# EAGLE design forno-pcb2 (EAGLE 6.5.0)
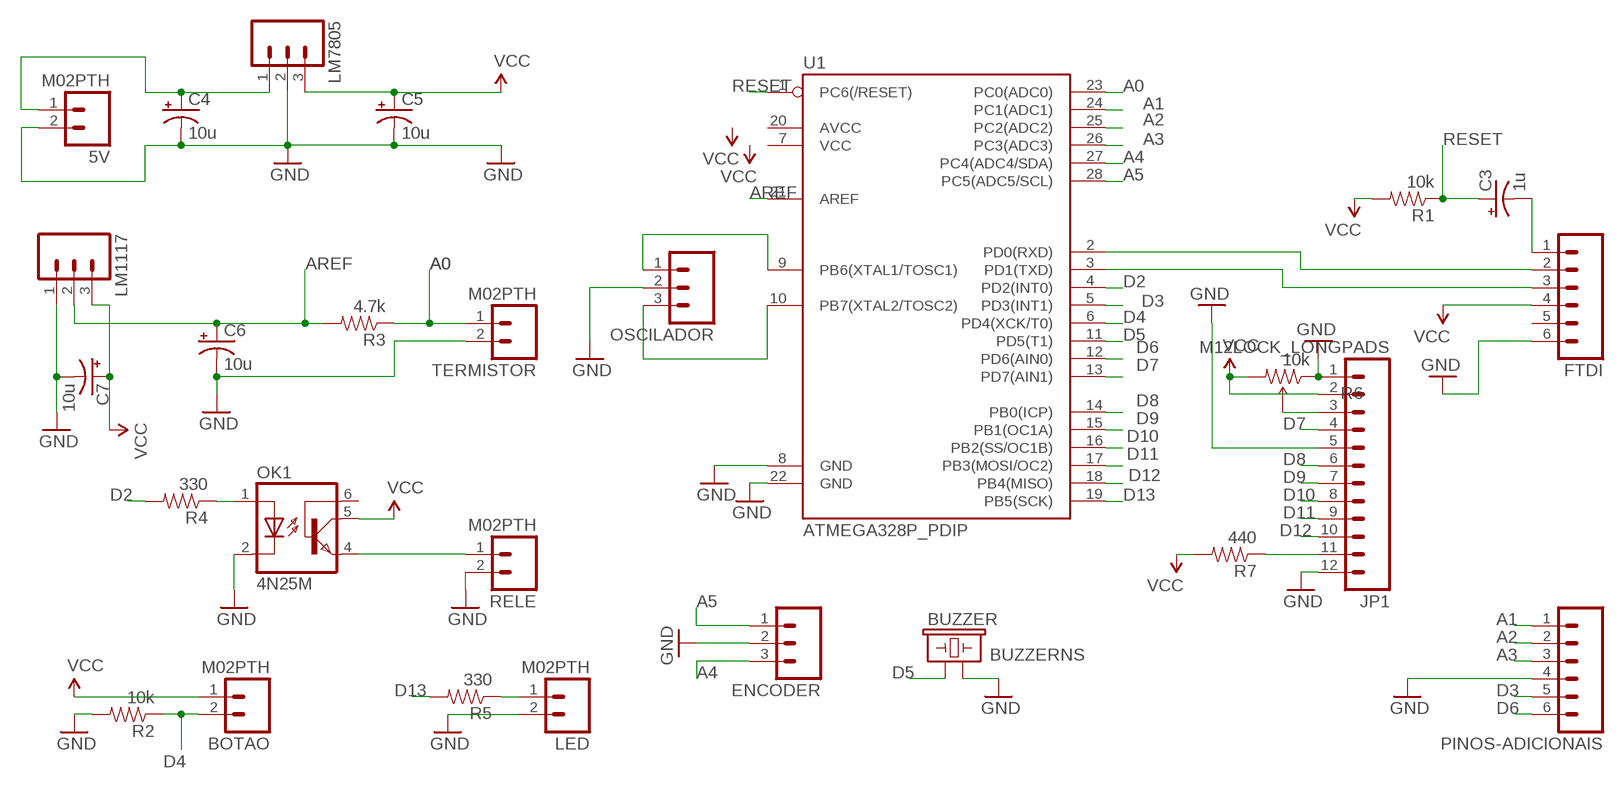
[diagram p0: schematic, sheet 1]

## Parts
5V  M02PTH  [1X02]
BOTAO  M02PTH  [1X02]
BUZZER  BUZZERNS  [BUZZER-12MM-NS]
C3  1u  CAP_POLPTH2  [CPOL-RADIAL-10UF-25V]
C4  10u  CAP_POLPTH2  [CPOL-RADIAL-10UF-25V]
C5  10u  CAP_POLPTH2  [CPOL-RADIAL-10UF-25V]
C6  10u  CAP_POLPTH2  [CPOL-RADIAL-10UF-25V]
C7  10u  CAP_POLPTH2  [CPOL-RADIAL-10UF-25V]
ENCODER  M03POLAR  [MOLEX-1X3]
FTDI  M06SIP  [1X06]
JP1  M12LOCK_LONGPADS  [1X12_LOCK_LONGPADS]
LED  M02PTH  [1X02]
LM1117  M03POLAR  [MOLEX-1X3]
LM7805  M03POLAR  [MOLEX-1X3]
OK1  4N25M  [DIL06]
OSCILADOR  M03POLAR  [MOLEX-1X3]
PINOS-ADICIONAIS  M06SIP  [1X06]
R1  10k  RESISTORPTH-1/6W  [1/6W-RES]
R2  10k  RESISTORPTH-1/6W  [1/6W-RES]
R3  4.7k  RESISTORPTH-1/6W  [1/6W-RES]
R4  330  RESISTORPTH-1/6W  [1/6W-RES]
R5  330  RESISTORPTH-1/6W  [1/6W-RES]
R6  10k  TRIMPOTPTH  [TRIM_POT_PTH]
R7  440  RESISTORPTH-1/6W  [1/6W-RES]
RELE  M02PTH  [1X02]
TERMISTOR  M02PTH  [1X02]
U1  ATMEGA328P_PDIP  [DIL28-3]

## Nets
A0: R3.1 TERMISTOR.1 U1.23(PC0(ADC0))
A1: PINOS-ADICIONAIS.1 U1.24(PC1(ADC1))
A2: PINOS-ADICIONAIS.2 U1.25(PC2(ADC2))
A3: PINOS-ADICIONAIS.3 U1.26(PC3(ADC3))
A4: ENCODER.3 U1.27(PC4(ADC4/SDA))
A5: ENCODER.1 U1.28(PC5(ADC5/SCL))
AREF: C6.1(+) LM1117.2 R3.2 U1.21(AREF)
D2: R4.2 U1.4(PD2(INT0))
D3: PINOS-ADICIONAIS.5 U1.5(PD3(INT1))
D4: BOTAO.2 R2.1 U1.6(PD4(XCK/T0))
D5: BUZZER.+ U1.11(PD5(T1))
D6: PINOS-ADICIONAIS.6 U1.12(PD6(AIN0))
D7: JP1.4 U1.13(PD7(AIN1))
D8: JP1.6 U1.14(PB0(ICP))
D9: JP1.7 U1.15(PB1(OC1A))
D10: JP1.8 U1.16(PB2(SS/OC1B))
D11: JP1.9 U1.17(PB3(MOSI/OC2))
D12: JP1.10 U1.18(PB4(MISO))
D13: R5.2 U1.19(PB5(SCK))
GND: 5V.2 BUZZER.- C4.2(-) C5.2(-) C6.2(-) C7.2(-) ENCODER.2 FTDI.6 JP1.1 JP1.5 JP1.12 LED.2 LM1117.1 LM7805.2 OK1.2(C) OSCILADOR.2 PINOS-ADICIONAIS.4 R2.2 R6.1(CCW) RELE.2 TERMISTOR.2 U1.8(GND) U1.22(GND)
N$1: FTDI.2 U1.2(PD0(RXD))
N$2: FTDI.3 U1.3(PD1(TXD))
N$3: C3.2(-) FTDI.1
N$4: 5V.1 C4.1(+) LM7805.1
N$5: OK1.1(A) R4.1
N$6: OK1.4(EMI) RELE.1
N$7: OSCILADOR.1 U1.9(PB6(XTAL1/TOSC1))
N$8: OSCILADOR.3 U1.10(PB7(XTAL2/TOSC2))
N$9: LED.1 R5.1
N$11: JP1.3 R6.2(WIPER)
N$28: JP1.11 R7.1
RESET: C3.1(+) R1.1 U1.1(PC6(/RESET))
VCC: BOTAO.1 C5.1(+) C7.1(+) FTDI.4 JP1.2 LM1117.3 LM7805.3 OK1.5(COL) R1.2 R6.3(CW) R7.2
Unconnected: FTDI.5 OK1.6(BAS) U1.7(VCC) U1.20(AVCC)

## Library data of the parts
5V BOTAO LED RELE TERMISTOR = SparkFun-Connectors:M02: Standard 2-pin 0.1" header. Use with - straight break away headers ( PRT-00116) - right angle break away headers (PRT-00553) - swiss pins (PRT-00743) - machine pins (PRT-00117) - female headers (PRT-00115) Molex polarized connector foot print use with: PRT-08233 with associated crimp pins and housings. 2.54_SCREWTERM for use with PRT-10571. 3.5mm Screw Terminal footprints for PRT-08084 5mm Screw Terminal footprints for use with PRT-08433
BUZZER = SparkFun-Electromechanical:BUZZER: Buzzer 12mm Spark Fun Electronics SKU : Comp-Buzzer
C3-C7 = SparkFun-Passives:CAP_POL: Capacitor Polarized These are standard SMD and PTH capacitors. Normally 10uF, 47uF, and 100uF in electrolytic and tantalum varieties. Always verify the external diameter of the through hole cap, it varies with capacity, voltage, and manufacturer. The EIA devices should be standard.
ENCODER LM1117 LM7805 OSCILADOR = SparkFun-Connectors:M03: Header 3 Standard 3-pin 0.1" header. Use with straight break away headers (SKU : PRT-00116), right angle break away headers (PRT-00553), swiss pins (PRT-00743), machine pins (PRT-00117), and female headers (PRT-00115). Molex polarized connector foot print use with SKU : PRT-08232 with associated crimp pins and housings.
FTDI PINOS-ADICIONAIS = SparkFun-Connectors:M06: Header 6 Standard 6-pin 0.1" header. Use with straight break away headers (SKU : PRT-00116), right angle break away headers (PRT-00553), swiss pins (PRT-00743), machine pins (PRT-00117), and female headers (PRT-00115). Molex polarized connector foot print use with SKU : PRT-08094 with associated crimp pins and housings. NOTES ON THE VARIANTS LOCK and LOCK_LONGPADS... This footprint was designed to help hold the alignment of a through-hole component (i.e. 6-pin header) while soldering it into place. You may notice that each hole has been shifted either up or down by 0.005 of an inch from it's more standard position (which is a perfectly straight line). This slight alteration caused the pins (the squares in the middle) to touch the edges of the holes. Because they are alternating, it causes a "brace" to hold the component in place. 0.005 has proven to be the perfect amount of "off-center" position when using our standard breakaway headers. Although looks a little odd when you look at the bare footprint, once you have a header in there, the alteration is very hard to notice. Also,if you push a header all the way into place, it is covered up entirely on the bottom side. This idea of altering the position of holes to aid alignment will be further integrated into the Sparkfun Library for other footprints. It can help hold any component with 3 or more connection pins.
JP1 = SparkFun-Connectors:M12: Header 12 Standard 12-pin 0.1" header. Use with straight break away headers (SKU : PRT-00116), right angle break away headers (PRT-00553), swiss pins (PRT-00743), machine pins (PRT-00117), and female headers (PRT-00115).
OK1 = optocoupler:4N*?M: General Purpose 6-Pin Phototransistor Optocouplers Source: http://www.fairchildsemi.com/ds/4N/4N35-M.pdf; MPN: 4N25-M; OC_FARNELL: 1021349; OC_NEWARK: 98K9084
R1-R5 R7 = SparkFun-Passives:RESISTOR: Resistor Basic schematic elements and footprints for 0603, 1206, and PTH resistors.
R6 = SparkFun-Electromechanical:TRIMPOT: Various small potentiometers for "set-and-forget" applications
U1 = SparkFun-DigitalIC:ATMEGA328P_PDIP: uC used in the Arduino 32kb flash, 1k EEPROM, 2k SRAM This is the through-hole version of this chip.

## Board
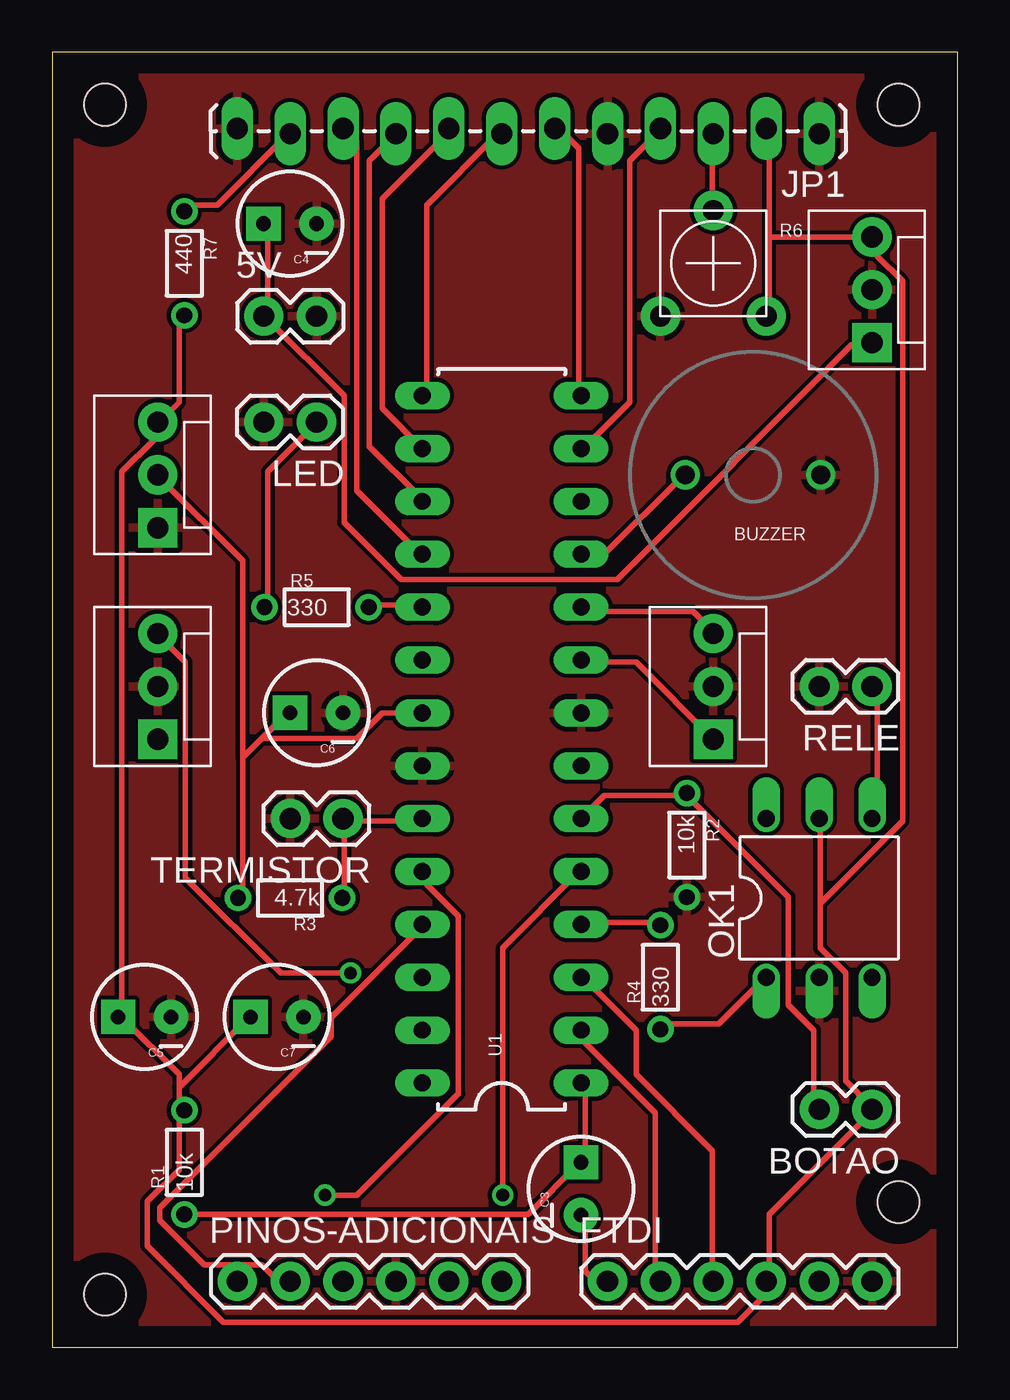
[diagram p1: board, top side]
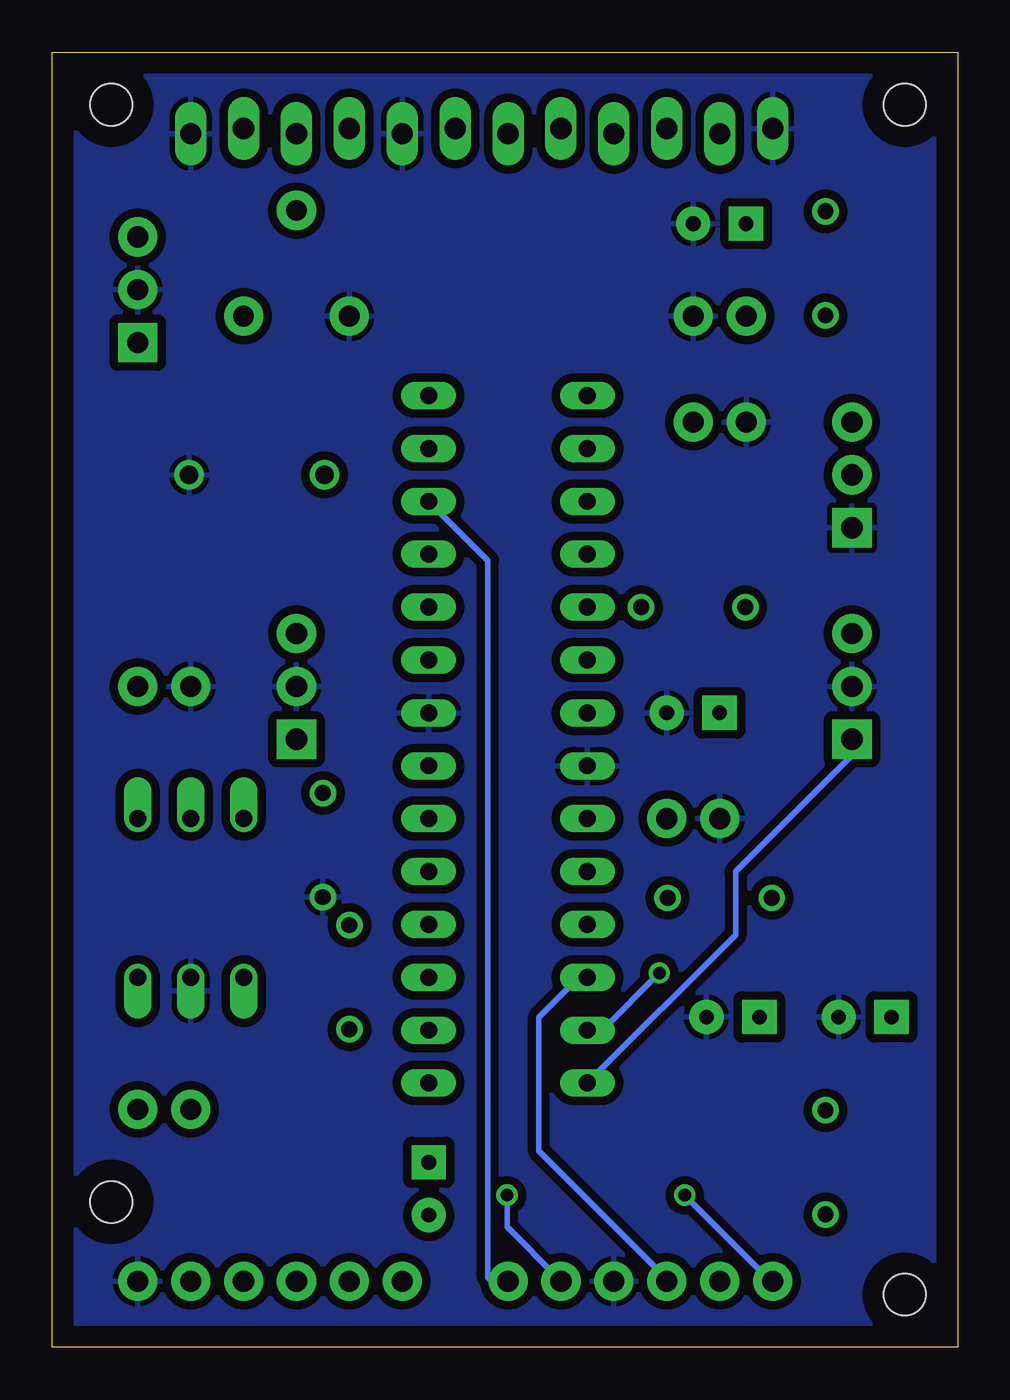
[diagram p2: board, bottom side, seen from below]

Size 43.48 x 62.22 mm. Coordinates in mm from the lower left corner, seen from the top.
Outline: 0,0 43.48,0 43.48,62.22 0,62.22 0,0
Copper layers (1*16): Top 0.035mm / dielectric 1.5mm / Bottom 0.035mm
Design rules "default": minimum track width 10mil, minimum drill 24mil, track to track 8mil, track to pad 8mil, pad to pad 8mil, via to via 8mil, smd to smd 8mil, copper to edge 40mil, drill to drill 8mil, minimum pad ring 10mil, minimum via ring 8mil, stop-mask expansion 4mil, vias tented up to drill 0mil, thermal gap 10mil
Holes 2 mm at 2.54,59.69 40.64,59.69 2.54,2.54 40.64,6.99

### Footprints (pad centres in the part's own frame; a part is rotated, then mirrored left to right if it is on the bottom)
1X02 = drill 1.016 pad 1.88: 1 0,0; 2 2.54,0
BUZZER-12MM-NS = drill 0.9: + 3.25,0; - -3.25,0
CPOL-RADIAL-10UF-25V = drill 0.7 pad 1.651 square: 1 1.27,0 | drill 0.7 pad 1.651: 2 -1.27,0
MOLEX-1X3 = drill 1.016 pad 1.88 square: 1 0,0 | drill 1.016 pad 1.88: 2 2.54,0; 3 5.08,0
1X06 = drill 1.016 pad 1.88: 1 0,0; 2 2.54,0; 3 5.08,0; 4 7.62,0; 5 10.16,0; 6 12.7,0
1X12_LOCK_LONGPADS = drill 1.016 long: 1 0,0.127; 2 2.54,-0.127; 3 5.08,0.127; 4 7.62,-0.127; 5 10.16,0.127; 6 12.7,-0.127; 7 15.24,0.127; 8 17.78,-0.127; 9 20.32,0.127; 10 22.86,-0.127; 11 25.4,0.127; 12 27.94,-0.127
DIL06 = drill 0.813 offset: 1 -2.54,-3.81; 2 0,-3.81; 3 2.54,-3.81; 4 2.54,3.81; 5 0,3.81; 6 -2.54,3.81
1/6W-RES = drill 0.762: 1 -2.5,0; 2 2.5,0
TRIM_POT_PTH = drill 1 pad 1.88: 1 -2.54,-2.54; 2 0,2.54; 3 2.54,-2.54
DIL28-3 = drill 0.813 long: 1 -16.51,-3.81; 2 -13.97,-3.81; 3 -11.43,-3.81; 4 -8.89,-3.81; 5 -6.35,-3.81; 6 -3.81,-3.81; 7 -1.27,-3.81; 8 1.27,-3.81; 9 3.81,-3.81; 10 6.35,-3.81; 11 8.89,-3.81; 12 11.43,-3.81; 13 13.97,-3.81; 14 16.51,-3.81; 15 16.51,3.81; 16 13.97,3.81; 17 11.43,3.81; 18 8.89,3.81; 19 6.35,3.81; 20 3.81,3.81; 21 1.27,3.81; 22 -1.27,3.81; 23 -3.81,3.81; 24 -6.35,3.81; 25 -8.89,3.81; 26 -11.43,3.81; 27 -13.97,3.81; 28 -16.51,3.81

### Placement (x,y rotation side)
5V  10.16,49.53 0 top
BOTAO  39.37,11.43 180 top
BUZZER  33.66,41.91 180 top
C3  25.4,7.62 90 top
C4  11.43,53.98 180 top
C5  4.45,15.88 180 top
C6  12.7,30.48 180 top
C7  10.79,15.88 180 top
ENCODER  5.08,29.21 90 top
FTDI  26.67,3.17 0 top
JP1  36.83,58.42 180 top
LED  12.7,44.45 180 top
LM1117  5.08,39.37 90 top
LM7805  39.37,48.26 90 top
OK1  36.83,21.59 0 top
OSCILADOR  31.75,29.21 90 top
PINOS-ADICIONAIS  8.89,3.17 0 top
R1  6.35,8.89 90 top
R2  30.48,24.13 270 top
R3  11.43,21.59 180 top
R4  29.21,17.78 90 top
R5  12.7,35.56 0 top
R6  31.75,52.07 0 top
R7  6.35,52.07 270 top
RELE  39.37,31.75 180 top
TERMISTOR  13.97,25.4 180 top
U1  21.59,29.21 90 top

### Tracks (layer width: path | path; a pad name or v marks a point on that pad's centre or on a via)
A0
  Top 0.254: 14.02,25.3 14.02,21.64 R3.1 | 14.02,25.3 17.68,25.3 U1.23 | 14.02,25.3 TERMISTOR.1
A1  (via drill 0.61)
  Top 0.254: v13.11,7.32 14.63,7.32 19.51,12.19 19.51,20.73 17.98,22.25 17.98,22.86 U1.24
  Bottom 0.254: v13.11,7.32 9.14,3.35 9.14,2.74 PINOS-ADICIONAIS.1
A2
  Top 0.254: U1.25 17.68,20.12 13.41,15.85 13.41,14.94 5.18,6.71 5.18,6.1 7.32,3.96 10.06,3.96 11.28,2.74 PINOS-ADICIONAIS.2
A3
  Bottom 0.254: U1.26 17.98,17.68 18.29,17.68 20.12,15.85 20.12,9.45 14.02,3.35 14.02,2.74 PINOS-ADICIONAIS.3
A4  (via drill 0.61)
  Top 0.254: v14.33,17.98 10.97,17.98 6.4,22.55 6.4,32.92 5.18,34.14 ENCODER.3
  Bottom 0.254: U1.27 17.07,15.24 v14.33,17.98
A5
  Bottom 0.254: U1.28 10.67,19.81 10.67,22.86 5.18,28.35 5.18,28.96 ENCODER.1
AREF
  Top 0.254: 9.14,28.35 9.14,21.64 R3.2 | 10.06,29.26 11.28,30.48 C6.1 | 10.06,29.26 9.14,28.35 | U1.21 15.85,30.48 14.63,29.26 10.06,29.26 | 9.14,28.35 9.14,37.8 5.18,41.76 LM1117.2
D2
  Top 0.254: R4.2 28.96,20.42 25.6,20.42 U1.4
D3  (via drill 0.61)
  Top 0.254: v21.64,7.32 21.64,19.2 25.3,22.86 U1.5
  Bottom 0.254: v21.64,7.32 21.64,5.79 19.2,3.35 19.2,2.74 PINOS-ADICIONAIS.5
D4
  Top 0.254: 30.48,26.52 26.52,26.52 U1.6 | 30.48,26.52 35.36,21.64 35.36,16.46 36.58,15.24 36.58,11.58 BOTAO.2 | 30.48,26.52 R2.1
D5
  Top 0.254: U1.11 26.52,38.1 30.18,41.76 BUZZER.+
D6
  Bottom 0.254: U1.12 22.55,37.8 22.55,3.35 21.64,2.44 PINOS-ADICIONAIS.6
D7
  Top 0.254: U1.13 25.6,43.28 27.74,45.41 27.74,57 29.26,58.52 JP1.4
D8
  Top 0.254: U1.14 25.3,45.72 25.3,57.61 24.38,58.52 JP1.6
D9
  Top 0.254: U1.15 17.98,45.72 17.98,54.86 21.34,58.22 JP1.7
D10
  Top 0.254: U1.16 15.85,45.11 15.85,55.17 19.2,58.52 JP1.8
D11
  Top 0.254: U1.17 17.68,40.84 15.24,43.28 15.24,57 16.46,58.22 JP1.9
D12
  Top 0.254: U1.18 17.68,38.1 14.63,41.15 14.63,57.91 14.02,58.52 JP1.10
D13
  Top 0.254: R5.2 15.24,35.66 17.68,35.66 U1.19
GND
  pour Bottom (isolate 0.406): -1.27,74.93 -1.27,-1.27 52.07,-1.27 52.07,74.93
  pour Top: -1.27,62.23 44.45,62.23 44.45,43.18 44.45,-1.27 -1.27,-1.27 -1.27,0
N$1
  Top 0.254: U1.2 25.6,15.24 25.6,14.63 28.96,11.28 28.96,2.74 FTDI.2
N$2
  Top 0.254: U1.3 25.6,17.68 28.04,15.24 28.04,13.11 31.7,9.45 31.7,2.74 FTDI.3
N$3
  Top 0.254: C3.2 25.6,6.1 25.6,3.66 26.52,2.74 FTDI.1
N$4
  Top 0.254: C4.1 10.36,53.95 10.36,49.68 5V.1 10.36,49.38 14.02,45.72 14.02,39.62 16.76,36.88 27.13,36.88 38.41,48.16 39.32,48.16 LM7805.1
N$5
  Top 0.254: R4.1 29.26,15.54 32,15.54 34.14,17.68 OK1.1
N$6
  Top 0.254: OK1.4 39.62,25.6 39.62,31.7 RELE.1
N$7
  Top 0.254: OSCILADOR.1 28.04,32.92 25.6,32.92 U1.9
N$8
  Top 0.254: U1.10 25.6,35.36 30.79,35.36 31.7,34.44 OSCILADOR.3
N$9
  Top 0.254: R5.1 10.36,35.66 10.36,42.06 12.5,44.2 LED.1
N$11
  Top 0.254: JP1.3 31.7,58.22 31.7,54.86 R6.2
N$28
  Top 0.254: R7.1 6.4,54.86 7.92,54.86 11.28,58.22 JP1.11
RESET
  Top 0.254: R1.1 6.4,6.4 22.86,6.4 25.3,8.84 C3.1 25.6,9.14 25.6,12.5 U1.1
VCC
  Top 0.254: R7.2 6.1,49.38 6.1,45.41 5.18,44.5 LM1117.3 4.88,44.2 4.88,43.59 3.35,42.06 3.35,16.15 C5.1 3.35,15.85 6.1,13.11 6.1,12.5 | 6.1,12.5 6.1,11.58 R1.2 6.1,11.28 6.1,8.53 4.57,7.01 4.57,4.88 8.23,1.22 32.92,1.22 34.14,2.44 FTDI.4 34.44,2.74 34.44,6.4 39.32,11.28 BOTAO.1 39.32,11.58 38.1,12.8 38.1,17.98 36.88,19.2 36.88,21.34 | 6.1,12.5 9.45,15.85 C7.1 | 34.44,53.34 34.44,49.68 R6.3 | 34.44,53.34 34.44,58.52 JP1.2 | 34.44,53.34 LM7805.3 39.62,53.34 39.62,52.43 40.84,51.21 40.84,25.3 36.88,21.34 | 36.88,21.34 36.88,25.3 OK1.5